# EAGLE design Nintendo 3DS USB-C (EAGLE 6.2)
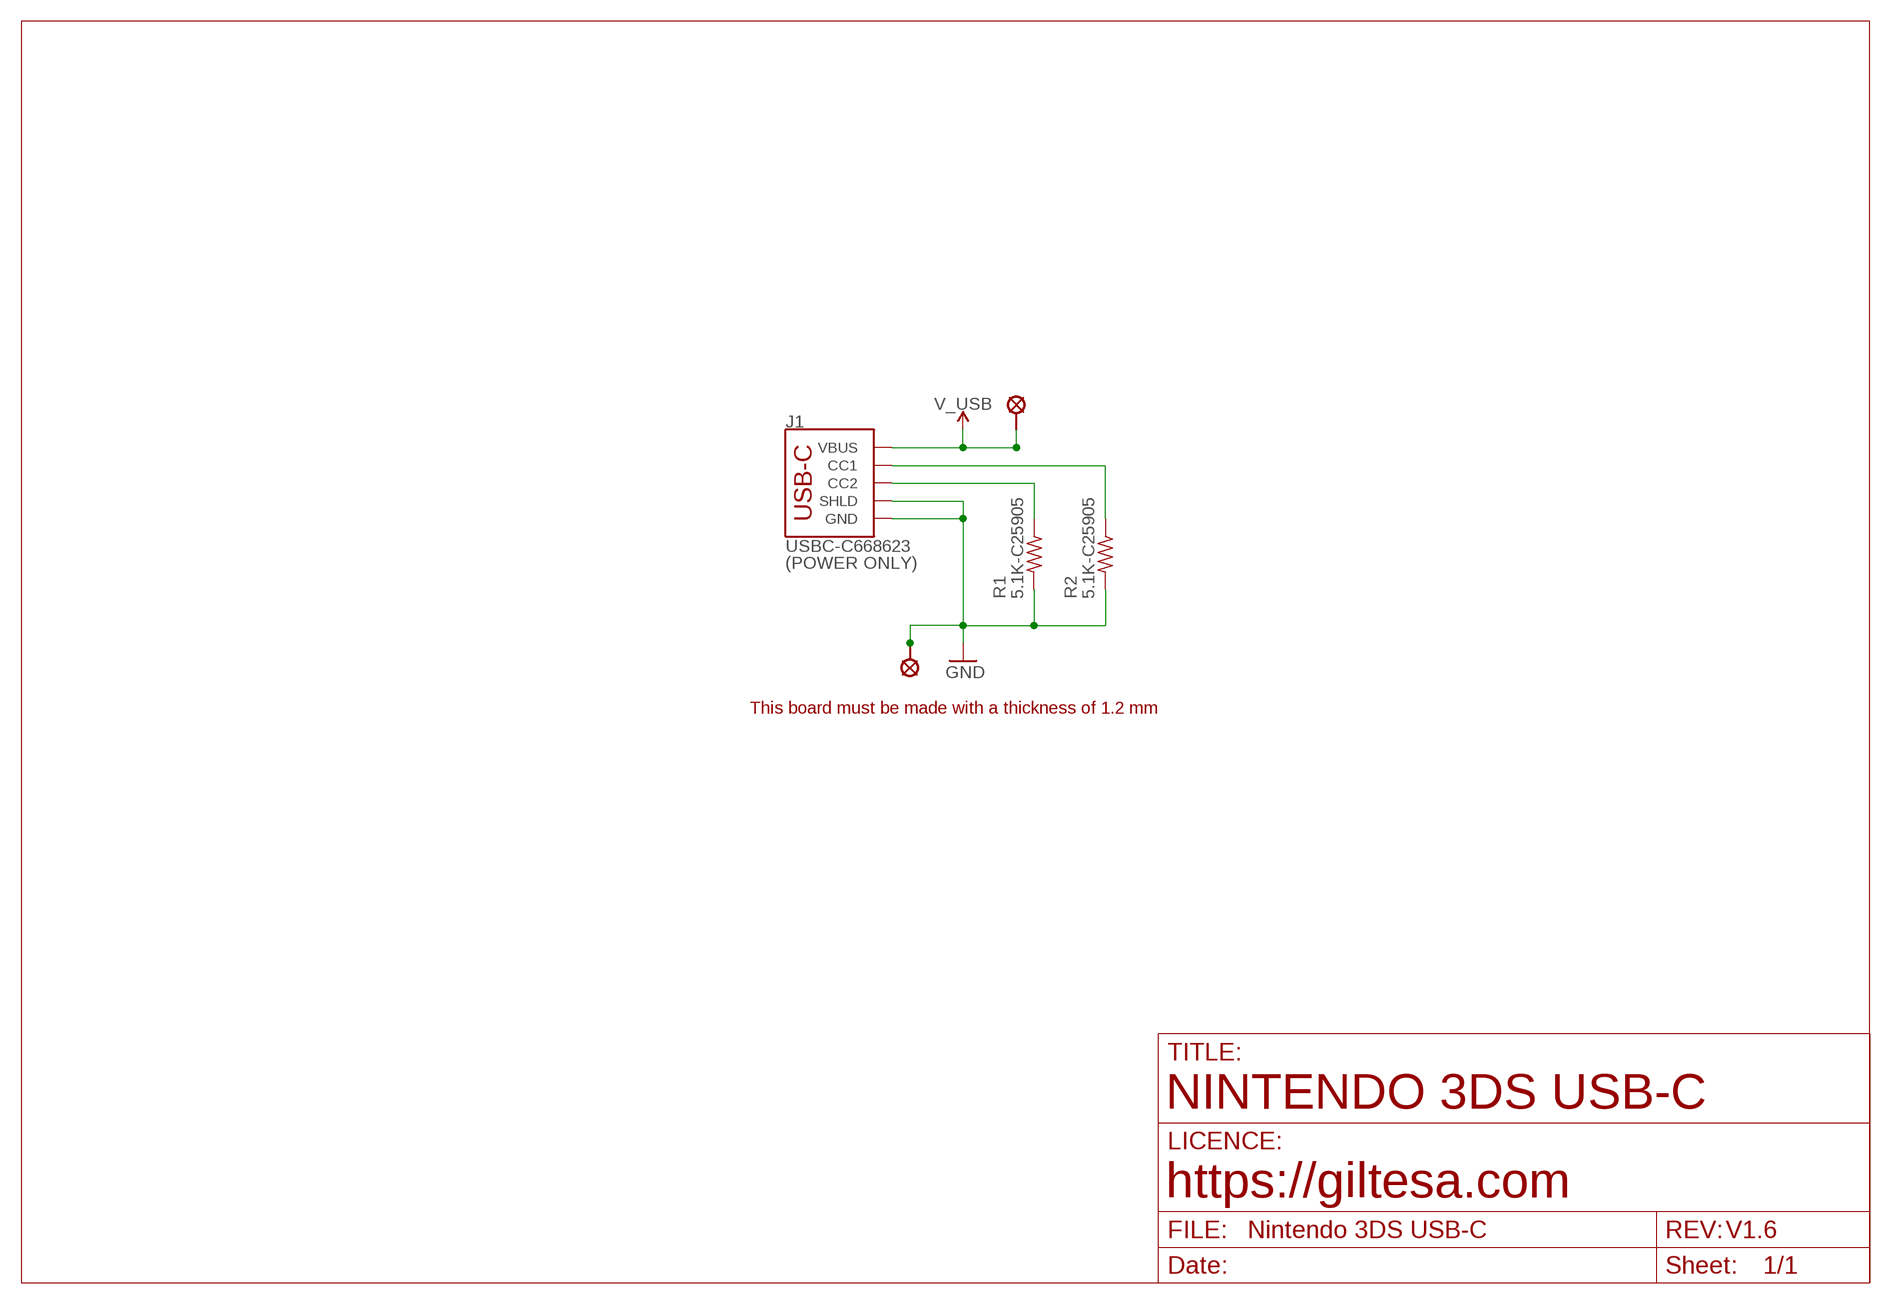
[diagram p0: schematic, sheet 1]

## Parts
J1  USBC-C668623  USB-CPOWER  [USB-C_6P]
R1  5.1K-C25905  R0402  [R0402]
R2  5.1K-C25905  R0402  [R0402]
U$2  PAD_1.0  [PAD_1.0]
U$3  PAD_1.0  [PAD_1.0]
U$4  PAD_1.0  [PAD_1.0]
U$6  PAD_1.0  [PAD_1.0]
U$7  PAD_1.0  [PAD_1.0]
U$8  PAD_1.0  [PAD_1.0]

## Nets
GND: J1.GND1(GND) J1.GND2(GND) J1.SHLD1(SHLD) J1.SHLD2(SHLD) J1.SHLD3(SHLD) J1.SHLD4(SHLD) J1.SHLD5(SHLD) J1.SHLD6(SHLD) J1.SHLD7(SHLD) J1.SHLD8(SHLD) R1.2 R2.2 U$4.P$1 U$6.P$1 U$7.P$1 U$8.P$1
N$4: J1.B5(CC2) R1.1
N$13: J1.A5(CC1) R2.1
V_USB: J1.VBUS1(VBUS) J1.VBUS2(VBUS) U$2.P$1 U$3.P$1

## Notes on the sheet
- (POWER ONLY)
- This board must be made with a thickness of 1.2 mm
- NINTENDO 3DS USB-C
- https://giltesa.com
- V1.6

## Library data of the parts
J1 = ,giltesa:USB-C
R1 R2 = ,giltesa:R0402
U$2-U$4 U$6-U$8 = ,giltesa:PAD

## Net classes
1 power: width 0.61 mm, drill 0.406 mm, clearance 0.203 mm
2 gnd: width 0.305 mm, drill 0.406 mm, clearance 0.203 mm
3 power usb: width 0.508 mm, drill 0.406 mm, clearance 0.203 mm

## Board
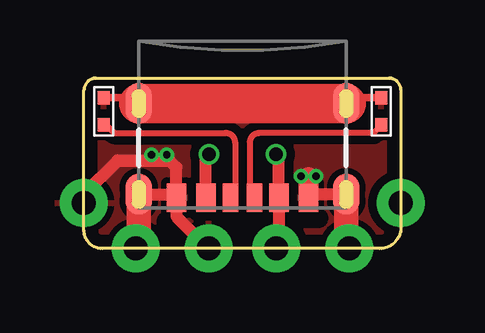
[diagram p1: board, top side]
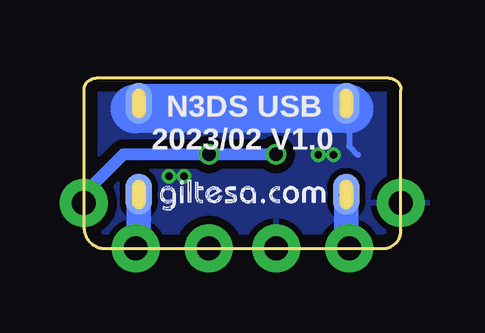
[diagram p2: board, bottom side, seen from below]

Size 13.21 x 7.11 mm. Coordinates in mm from the lower left corner, seen from the top.
Outline: 13.21,6.6 13.21,0.89 arc-90 12.32,0 0.76,0 arc-90 0,0.76 0,6.6 arc-90 0.51,7.11 12.7,7.11 arc-90 13.21,6.6
Copper layers (1*16): Top 0.035mm / dielectric 1.6mm / Bottom 0.035mm
Design rules: minimum track width 6mil, minimum drill 12mil, track to track 6mil, track to pad 6mil, pad to pad 6mil, via to via 8mil, smd to smd 0mil, copper to edge 20mil, drill to drill 10mil, minimum pad ring 6mil, minimum via ring 6mil, stop-mask expansion 0mil, vias tented up to drill 100mil, thermal gap 10mil
tRestrict: 4 lines

### Footprints (pad centres in the part's own frame; a part is rotated, then mirrored left to right if it is on the bottom)
USB-C_6P = smd 0.635 x 1.2: A5 -0.5,-0.017; B5 0.5,-0.017 | smd 0.8 x 1.2: GND1 -2.75,-0.017; GND2 2.75,-0.017; VBUS1 -1.52,-0.017; VBUS2 1.52,-0.017 | smd 1.1 x 1.7: SHLD1 -4.32,-0.15; SHLD2 4.32,-0.15; SHLD5 -4.32,-3.95; SHLD8 4.32,-3.95 | smd 1.1 x 1.7 bottom: SHLD3 -4.32,-0.15; SHLD4 4.32,-0.15; SHLD6 -4.32,-3.95; SHLD7 4.32,-3.95
R0402 = smd 0.559 x 0.5: 1 -0.567,0; 2 0.567,0
PAD_1.0 = drill 1 pad 2: P$1 0,0

### Placement (x,y rotation side)
J1  6.6,2.11 180 top
R1  0.82,5.73 90 top
R2  12.38,5.73 90 top
U$2  8,0 0 top
U$3  13.21,1.91 0 top
U$4  5.21,0 0 top
U$6  0,1.91 0 top
U$7  2.16,0 0 top
U$8  11.05,0 0 top
U$11  [GILTESA.COM_MASK_7MM]  10.08,1.52 0 bottom

### Tracks (layer width: path | path; a pad name or v marks a point on that pad's centre or on a via)
GND  (via drill 0.3)  (1 unrouted)
  Top 0.254: 2.28,6.3 J1.SHLD8 | 10.92,6.3 J1.SHLD5
  Top 0.305: R1.2 2.28,6.3 | R2.2 10.92,6.3
  Top 0.508: U$6.P$1 0,2.29 1.4,3.68 3.56,3.68 3.85,3.38 J1.GND2 | J1.GND2 3.85,1.35 U$4.P$1 | 9.35,3 9.06,3 v9.67,3.02 | J1.SHLD4 3.72,2.26 J1.GND2 | J1.SHLD1 9.49,2.26 J1.GND1
  Top 0.8: J1.GND1 9.35,3
  Top 1.016: U$7.P$1 2.28,0.12 J1.SHLD4 | U$8.P$1 10.92,0.12 J1.SHLD1
  Top 1.651: J1.SHLD8 J1.SHLD5
  Bottom 0.127: J1.SHLD8 1.78,6.1 2.16,5.84 | 11.09,5.84 J1.SHLD5
  Bottom 0.254: 2.16,5.84 2.16,4.27 1.8,3.91
  Bottom 1.016: U$7.P$1 2.28,0.12 J1.SHLD4 | U$8.P$1 10.92,0.12 J1.SHLD1
  Bottom 2.032: 2.16,5.84 11.09,5.84
  other vias: 9.04,3.02 2.81,3.91 3.45,3.91
  pour Top (isolate 0.356): -1.15,7.96 14.36,7.96 14.36,-0.93 -1.15,-0.93
  pour Bottom (isolate 0.356): -1.15,7.96 14.36,7.96 14.36,-0.93 -1.15,-0.93
N$4
  Top 0.254: R1.1 0.93,5.16 1.27,4.83 5.91,4.83 arc-90 6.29,4.44 6.29,2.25 J1.B5
N$13
  Top 0.254: R2.1 12.38,5.14 12.07,4.83 7.3,4.83 arc90 6.91,4.44 6.91,2.25 J1.A5
V_USB  (via drill 0.56)
  Top 0.508: U$2.P$1 8.12,0.12 J1.VBUS1 8.12,3.81 v8,3.94 | J1.VBUS2 5.08,3.93 v5.21,3.94
  Bottom 0.508: v5.21,3.94 v8,3.94 11.56,3.94 13.21,2.29 U$3.P$1

### Text on the board
tPlace: 127mm | 0.0090766152086907
bPlace: N3DS USB | 2023/02 V1.0